# EAGLE schematic STM32F100C GB_Controller (EAGLE 7.2.0)
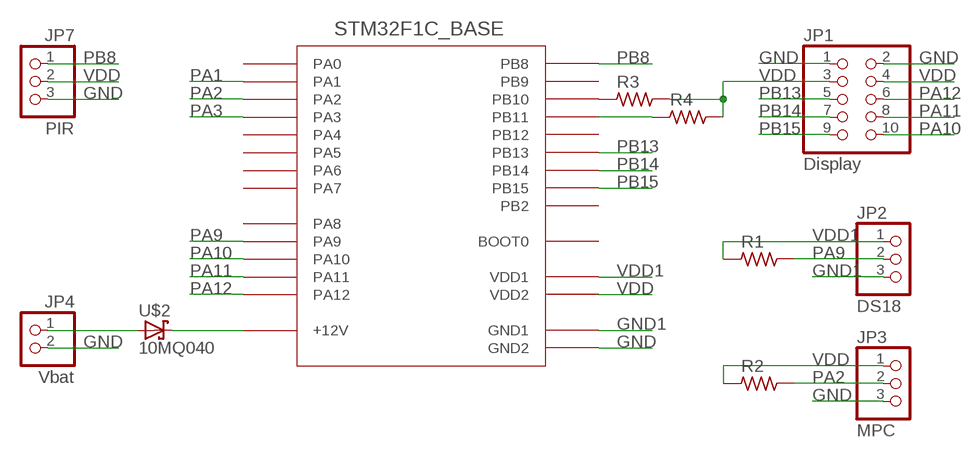
[diagram p0: schematic, sheet 1]

## Parts
JP1  Display  PINHD-2X05_2.54  [2X05]
JP2  DS18  PINHD-1X03_2.54-S  [1X03-S]
JP3  MPC  PINHD-1X03_2.54-S  [1X03-S]
JP4  Vbat  PINHD-1X02_2.54-S  [1X02-S]
JP7  PIR  PINHD-1X03_2.54-S  [1X03-S]
R1  R_1206  [R1206]
R2  R_1206  [R1206]
R3  R_1206  [R1206]
R4  R_1206  [R1206]
U$1  STM32F1C_BASE  [STM32F1_BASE]
U$2  10MQ040  [SMA]

## Nets
GND: JP1.1 JP1.2 JP3.3 JP4.2 JP7.3 U$1.GND1(GND2)
GND1: JP2.3 U$1.GND(GND1)
N$1: JP4.1 U$2.A
N$2: R4.1 U$1.PB11
N$3: R3.1 U$1.PB10
N$5: U$1.+12(+12V) U$2.C
PA1: U$1.PA1
PA2: JP3.2 R2.2 U$1.PA2
PA3: U$1.PA3
PA9: JP2.2 R1.2 U$1.PA9
PA10: JP1.10 U$1.PA10
PA11: JP1.8 U$1.PA11
PA12: JP1.6 U$1.PA12
PB8: JP7.1 U$1.PB8
PB13: JP1.5 U$1.PB13
PB14: JP1.7 U$1.PB14
PB15: JP1.9 U$1.PB15
VDD: JP1.3 JP1.4 JP3.1 JP7.2 R2.1 R3.2 R4.2 U$1.3.3_1(VDD2)
VDD1: JP2.1 R1.1 U$1.3.3(VDD1)
Unconnected: U$1.B2 U$1.BOOT0 U$1.PA0 U$1.PA4 U$1.PA5 U$1.PA6 U$1.PA7 U$1.PA8 U$1.PB9 U$1.PB12

## Library data of the parts
JP1 = pinhead-2:PINHD-2X05: PIN HEADER
JP2 JP3 JP7 = pinhead-2:PINHD-1X03: PIN HEADER
JP4 = pinhead-2:PINHD-1X02: PIN HEADER
R1-R4 = rc-master-smd:R_: RESISTOR
U$1 = my-library:STM32F1C_BASE: STM32F100C8 Base Board
U$2 = my-library:10MQ040: SCHOTTKY